# EAGLE design hub_i2c (EAGLE 5.06)
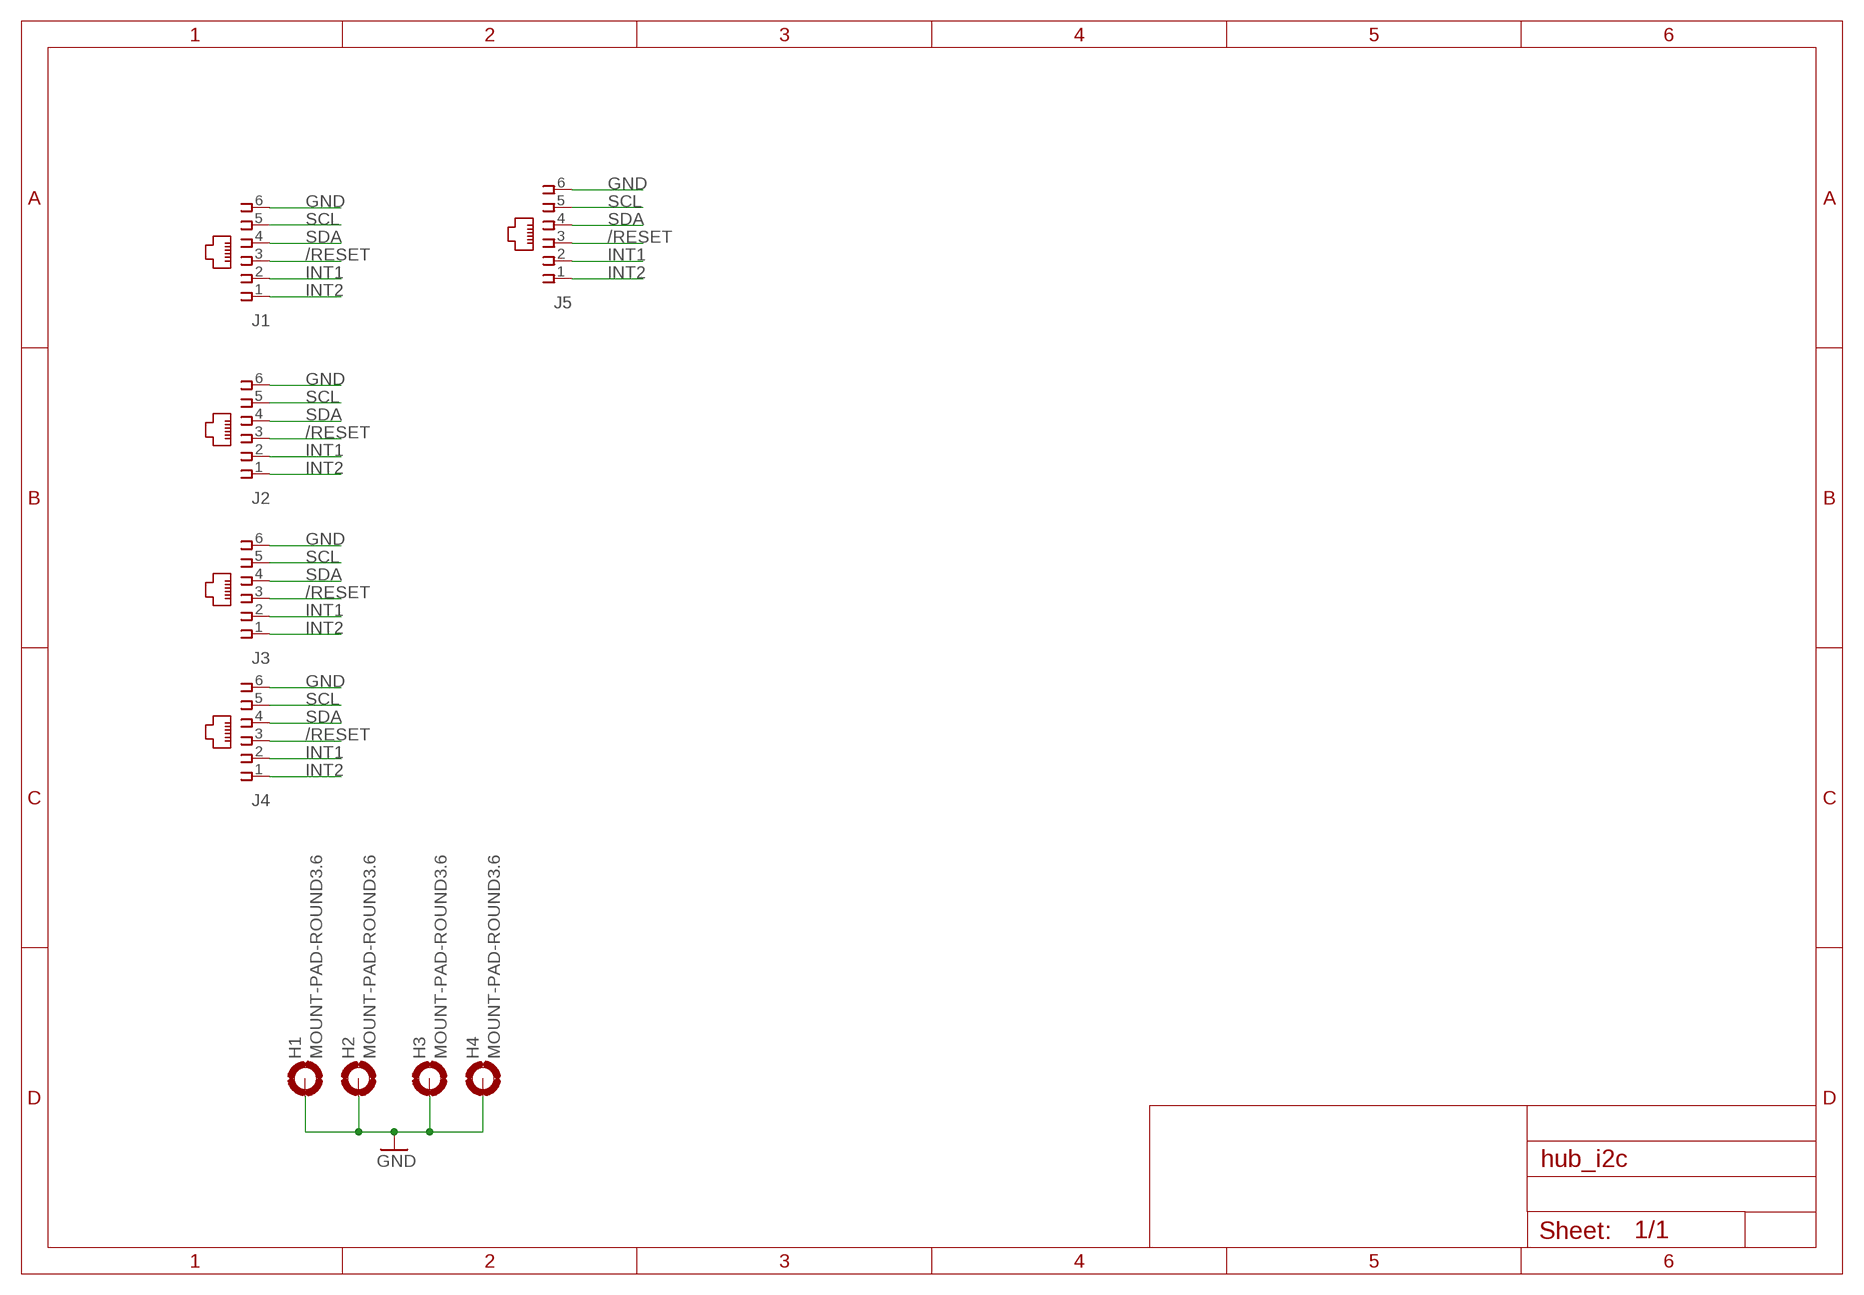
[diagram p0: schematic, sheet 1]

## Parts
H1  MOUNT-PAD-ROUND3.6  [3,6-PAD]
H2  MOUNT-PAD-ROUND3.6  [3,6-PAD]
H3  MOUNT-PAD-ROUND3.6  [3,6-PAD]
H4  MOUNT-PAD-ROUND3.6  [3,6-PAD]
J1  520258-3  [520258-3]
J2  520258-3  [520258-3]
J3  520258-3  [520258-3]
J4  520258-3  [520258-3]
J5  520258-3  [520258-3]

## Nets
/RESET: J1.3 J2.3 J3.3 J4.3 J5.3
GND: H1.B3,6(MOUNT) H2.B3,6(MOUNT) H3.B3,6(MOUNT) H4.B3,6(MOUNT) J1.6 J2.6 J3.6 J4.6 J5.6
INT1: J1.2 J2.2 J3.2 J4.2 J5.2
INT2: J1.1 J2.1 J3.1 J4.1 J5.1
SCL: J1.5 J2.5 J3.5 J4.5 J5.5
SDA: J1.4 J2.4 J3.4 J4.4 J5.4

## Library data of the parts
H1-H4 = holes:MOUNT-PAD-ROUND: MOUNTING PAD, round
J1-J5 = con-amp:520258-3: AMP connector

## Board
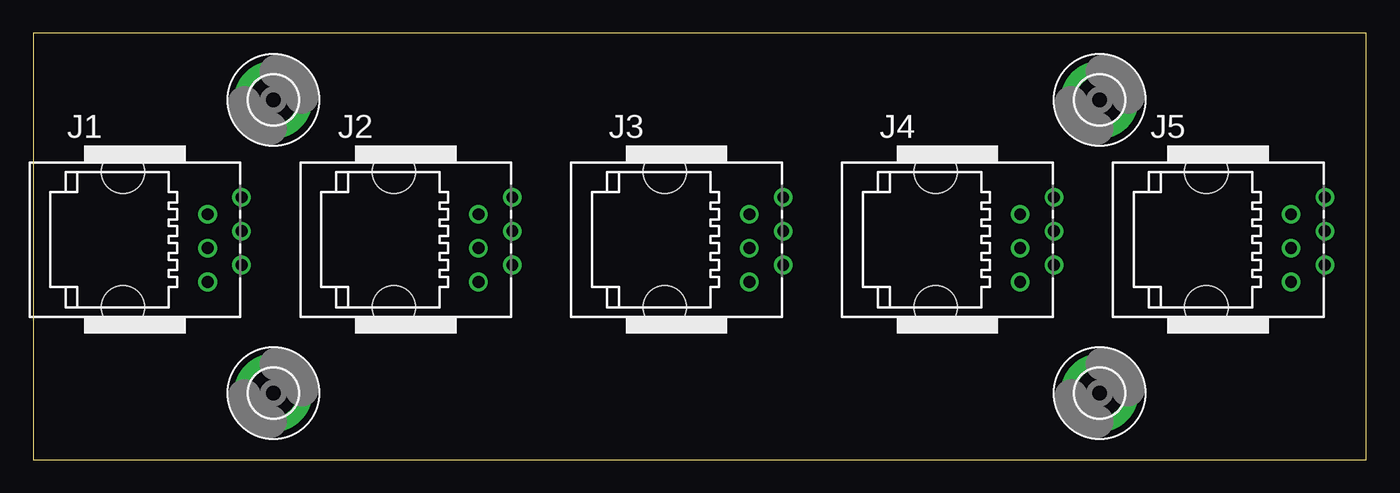
[diagram p1: board, top side]
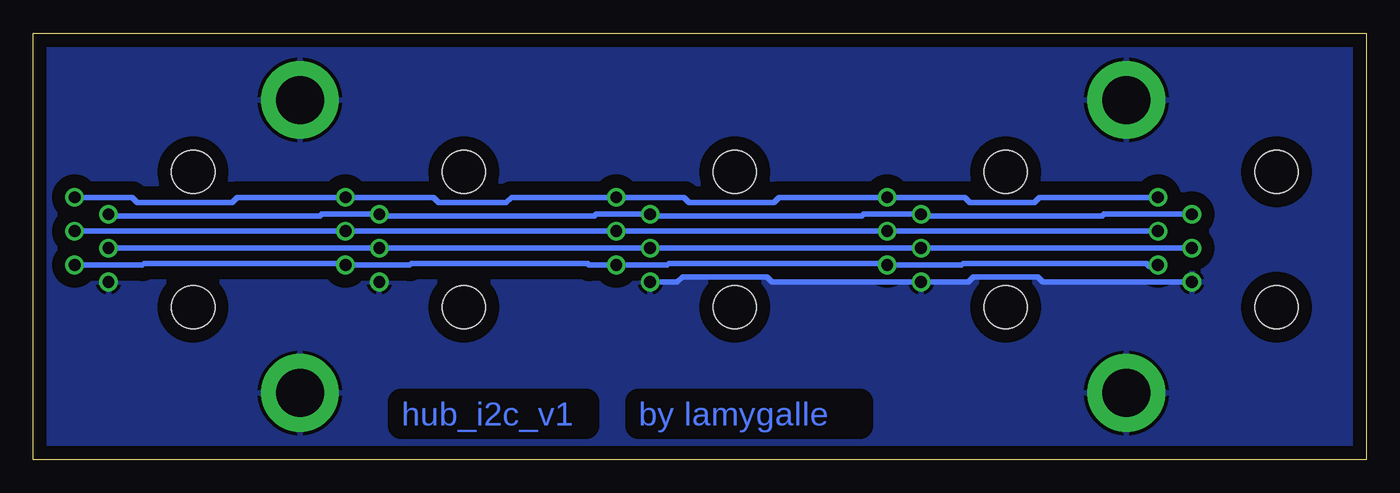
[diagram p2: board, bottom side, seen from below]

Size 100 x 32 mm. Coordinates in mm from the lower left corner, seen from the top.
Outline: 0,0 100,0 100,32 0,32 0,0
Copper layers (1*16): Top 0.035mm / dielectric 1.5mm / Bottom 0.035mm
Design rules "default *": minimum track width 10mil, minimum drill 24mil, track to track 1mm, track to pad 8mil, pad to pad 8mil, via to via 8mil, smd to smd 8mil, copper to edge 40mil, drill to drill 8mil, minimum pad ring 10mil, minimum via ring 8mil, stop-mask expansion 4mil, vias tented up to drill 0mil, thermal gap 10mil

### Footprints (pad centres in the part's own frame; a part is rotated, then mirrored left to right if it is on the bottom)
3,6-PAD = drill 3.6 pad 5.842 round: B3,6 0,0
520258-3 = drill 0.889 round: 1 -3.175,8.001; 2 -1.905,5.461; 3 -0.635,8.001; 4 0.635,5.461; 5 1.905,8.001; 6 3.175,5.461 | hole 3.251: -5.08,-0.889; 5.08,-0.889

### Placement (x,y rotation side)
H1  80,5 0 top
H2  80,27 0 top
H3  18,5 0 top
H4  18,27 0 top
J1  7.62,16.51 270 top
J2  27.94,16.51 270 top
J3  48.26,16.51 270 top
J4  68.58,16.51 270 top
J5  88.9,16.51 270 top

### Tracks (layer width: path | path; a pad name or v marks a point on that pad's centre or on a via)
/RESET
  Bottom 0.406: J1.3 J2.3 J3.3 J4.3 J5.3
GND
  Bottom 0.406: J3.6 51.69,13.34 51.31,13.72 44.96,13.72 44.58,13.34 J2.6 29.84,13.34 29.46,13.72 24.64,13.72 24.26,13.34 J1.6
  pour Bottom: -0.76,-1.27 101.85,-1.27 101.85,34.29 -0.76,34.29
INT1
  Bottom 0.406: J1.2 19.68,18.41 19.81,18.29 33.27,18.29 J2.2 37.72,18.41 37.85,18.29 53.59,18.29 J3.2 57.78,18.41 57.91,18.29 73.91,18.29 J4.2 78.36,18.41 78.49,18.29 94.23,18.29 J5.2
INT2
  Bottom 0.406: J1.1 24.51,19.68 24.89,19.3 29.72,19.3 30.1,19.68 J2.1 44.07,19.68 44.45,19.3 50.8,19.3 51.18,19.68 J3.1 64.14,19.68 64.52,19.3 69.6,19.3 69.98,19.68 J4.1 84.71,19.68 85.09,19.3 92.2,19.3 92.58,19.68 J5.1
SCL
  Bottom 0.406: J1.5 15.75,14.48 16.26,14.48 16.51,14.73 30.23,14.73 30.35,14.61 J2.5 36.07,14.73 52.32,14.73 52.45,14.61 J3.5 58.29,14.61 58.42,14.73 71.63,14.73 71.75,14.61 J4.5 76.71,14.73 91.69,14.73 91.82,14.61 J5.5
SDA
  Bottom 0.406: J5.4 J4.4 J3.4 J2.4 J1.4

### Text on the board
Bottom: by lamygalle | hub_i2c_v1